# EAGLE design MicroUSB_SMD (EAGLE 8.6.0)
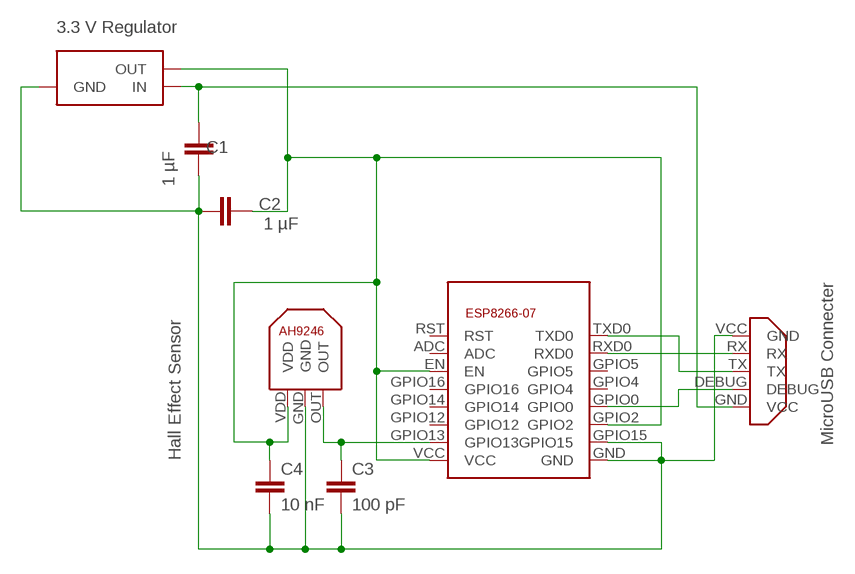
[diagram p0: schematic, sheet 1]

## Parts
C1  1 µF  0.33UF/330NF-0805-50V-10%  [0805]
C2  1 µF  0.33UF/330NF-0805-50V-10%  [0805]
C3  100 pF  0.33UF/330NF-0805-50V-10%  [0805]
C4  10 nF  0.33UF/330NF-0805-50V-10%  [0805]
U$1  ESP8266-07SMD  [ESP8266-07]
U$3  AH9246SC59  [SC59]
U$4  MICROUSB609-4613-1-ND  [MICROUSB]
U$5  AZ1117E  [SOT-223]

## Nets
N$1: C3.1 U$1.GPIO13 U$3.OUT
N$3: C2.2 C4.1 U$1.EN U$1.GPIO2 U$1.VCC U$3.VDD U$5.P$1(OUT) U$5.P$2(OUT)
N$4: C1.1 U$4.GND(VCC) U$5.P$4(IN)
N$5: C1.2 C2.1 C3.2 C4.2 U$1.GND U$1.GPIO15 U$3.GND U$4.VCC(GND) U$5.P$3(GND)
N$7: U$1.TXD0 U$4.TX
N$8: U$1.RXD0 U$4.RX
N$9: U$1.GPIO0 U$4.DEBUG
Unconnected: U$1.ADC U$1.GPIO4 U$1.GPIO5 U$1.GPIO12 U$1.GPIO14 U$1.GPIO16 U$1.RST

## Notes on the sheet
- 3.3 V Regulator
- MicroUSB Connecter
- Hall Effect Sensor

## Library data of the parts
C1-C4 = SparkFun-Capacitors:0.33UF/330NF: 0.33µF/330nF ceramic capacitors A capacitor is a passive two-terminal electrical component used to store electrical energy temporarily in an electric field.; PROD_ID: CAP-08469; VALUE: 0.33µF
U$1 = IoT:ESP8266-07
U$3 = IoT:AH9246
U$4 = IoT:MICROUSB
U$5 = IoT:AZ1117E: AZ1117E - 3.3 volt regulator Technical Specifications: Max Current 1.3 A Connect 1.0 uF cap from GND to IN Connect 1.0 uF cap from GND to OUT

## Board
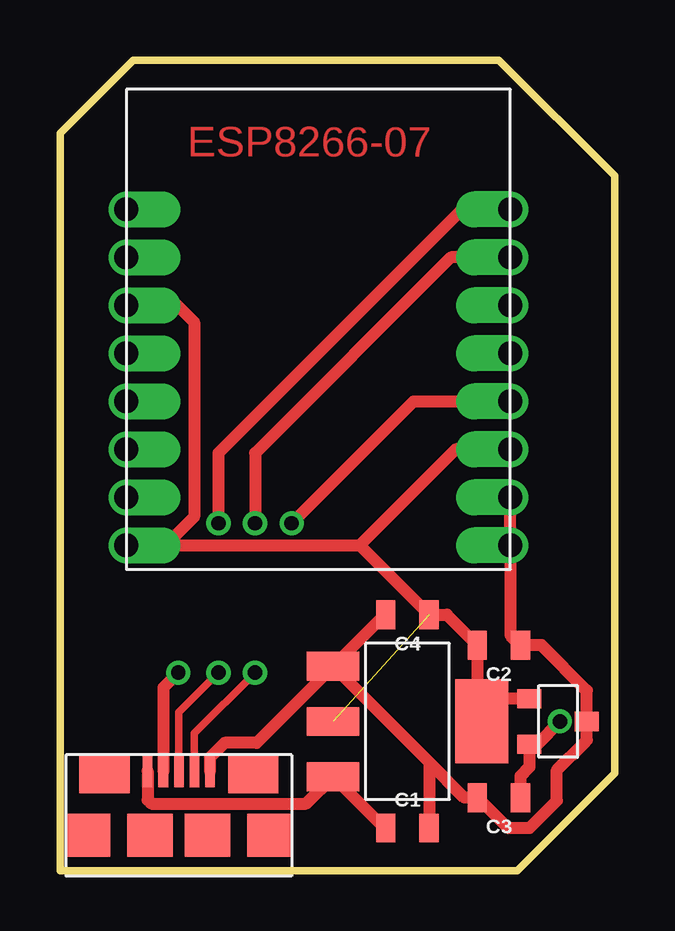
[diagram p1: board, top side]
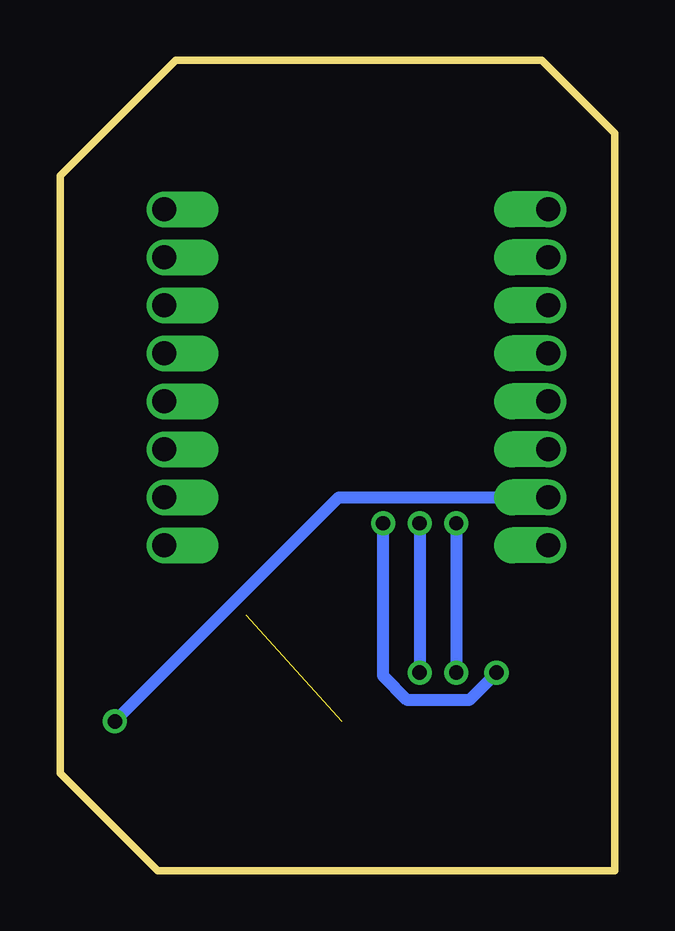
[diagram p2: board, bottom side, seen from below]

Size 23.11 x 33.78 mm. Coordinates in mm from the lower left corner, seen from the top.
Outline: 0,0 0,30.73 3.05,33.78 18.29,33.78 23.11,28.96 23.11,4.06 19.05,0 0,0
Copper layers (1*16): Top 0.035mm / dielectric 1.5mm / Bottom 0.035mm
Design rules "default": minimum track width 6mil, minimum drill 0.35mm, track to track 6mil, track to pad 6mil, pad to pad 6mil, via to via 6mil, smd to smd 6mil, copper to edge 40mil, drill to drill 6mil, minimum pad ring 10mil, minimum via ring 8mil, stop-mask expansion 4mil, vias tented up to drill 0mil, thermal gap 10mil

### Footprints (pad centres in the part's own frame; a part is rotated, then mirrored left to right if it is on the bottom)
0805 = smd 0.8 x 1.2: 1 -0.9,0; 2 0.9,0
ESP8266-07 = drill 1 pad 1.2 offset: ADC -6,6; EN -6,4; GND 10,-6; GPIO0 10,0; GPIO2 10,-2; GPIO4 10,2; GPIO5 10,4; GPIO12 -6,-2; GPIO13 -6,-4; GPIO14 -6,0; GPIO15 10,-4; GPIO16 -6,2; RST -6,8; RXD0 10,6; TXD0 10,8; VCC -6,-6
SC59 = smd 0.8 x 1: GND 0,2.4; OUT 0.95,0; VDD -0.95,0
MICROUSB = smd 0.4 x 1.35: DEBUG 0.65,0.675; GND 1.3,0.675; RX -0.65,0.675; TX 0,0.675; VCC -1.3,0.675 | smd 2.1 x 1.6: P$1 3.1,0.8; P$6 -3.1,0.8 | smd 1.9 x 1.8: P$2 3.8,3.35; P$3 -3.8,3.35; P$5 -1.2,3.35; P$7 1.2,3.35
SOT-223 = smd 3.5 x 2.2: P$1 0,3.1 | smd 1.2 x 2.2: P$2 0,-3.1; P$3 -2.3,-3.1; P$4 2.3,-3.1

### Placement (x,y rotation side)
C1  14.48,1.78 0 top
C2  18.29,9.4 180 top
C3  18.29,3.05 180 top
C4  14.48,10.67 180 top
U$1  8.76,19.56 0 top
U$3  19.56,6.22 270 top
U$4  4.95,4.83 180 top
U$5  14.48,6.22 270 top

### Tracks (layer width: path | path; a pad name or v marks a point on that pad's centre or on a via)
N$1  (via drill 0.6)
  Top 0.305: 19.88,5.27 U$3.OUT
  Top 0.508: C3.1 19.19,3.95 19.56,4.32 U$3.OUT | v20.83,6.22 19.88,5.27
  Bottom 0.508: v20.83,6.22 11.49,15.56 U$1.GPIO13
N$3  (1 unrouted)
  Top 0.305: 17.39,6.41 U$5.P$1 18.53,7.17
  Top 0.508: 17.39,6.41 C2.2 16.12,10.67 C4.1 12.49,13.56 | U$3.VDD 18.53,7.17 | 4.4,13.56 U$1.VCC | 4.4,13.56 12.49,13.56 | U$1.GPIO2 16.49,17.56 12.49,13.56 | U$1.EN 4.89,23.56 5.59,22.86 5.59,14.75 4.4,13.56
N$4
  Top 0.305: 11.43,3.92 U$5.P$4 11.38,3.72
  Top 0.508: U$4.GND 3.65,2.95 3.81,2.79 10.25,2.79 U$5.P$4 13.52,1.78 C1.1
N$5
  Top 0.305: 13.52,10.67 C4.2 | C2.1 19.19,8.99 | 10.81,8.52 U$5.P$3
  Top 0.508: 15.38,4.52 C1.2 | 15.38,4.52 U$5.P$3 | U$5.P$3 13.52,10.67 | 15.38,4.52 16.85,3.05 C3.2 18.67,1.78 19.56,1.78 20.7,2.92 20.7,4.2 21.84,5.33 21.96,5.45 U$3.GND 21.96,7.51 20.07,9.4 C2.1 18.76,9.82 U$1.GND U$1.GPIO15 | U$4.VCC 6.25,4.73 6.86,5.33 8.19,5.33 U$5.P$3
N$7  (via drill 0.6)
  Top 0.305: U$4.TX 4.95,6.6 v6.6,8.26
  Top 0.508: U$1.TXD0 16.76,27.56 6.6,17.4 v6.6,14.48
  Bottom 0.508: v6.6,14.48 v6.6,8.26
N$8  (via drill 0.6)
  Top 0.305: v8.13,8.26 5.6,5.73 U$4.RX
  Top 0.508: U$1.RXD0 16.29,25.56 8.13,17.4 v8.13,14.48
  Bottom 0.508: v8.13,14.48 v8.13,8.26
N$9  (via drill 0.6)
  Top 0.508: v9.65,14.48 14.73,19.56 U$1.GPIO0 | v4.93,8.26 4.3,7.63 U$4.DEBUG
  Bottom 0.508: v9.65,14.48 9.65,8.13 8.64,7.11 6.07,7.11 v4.93,8.26